# EAGLE design pcb_v3 (EAGLE 8.7.1)
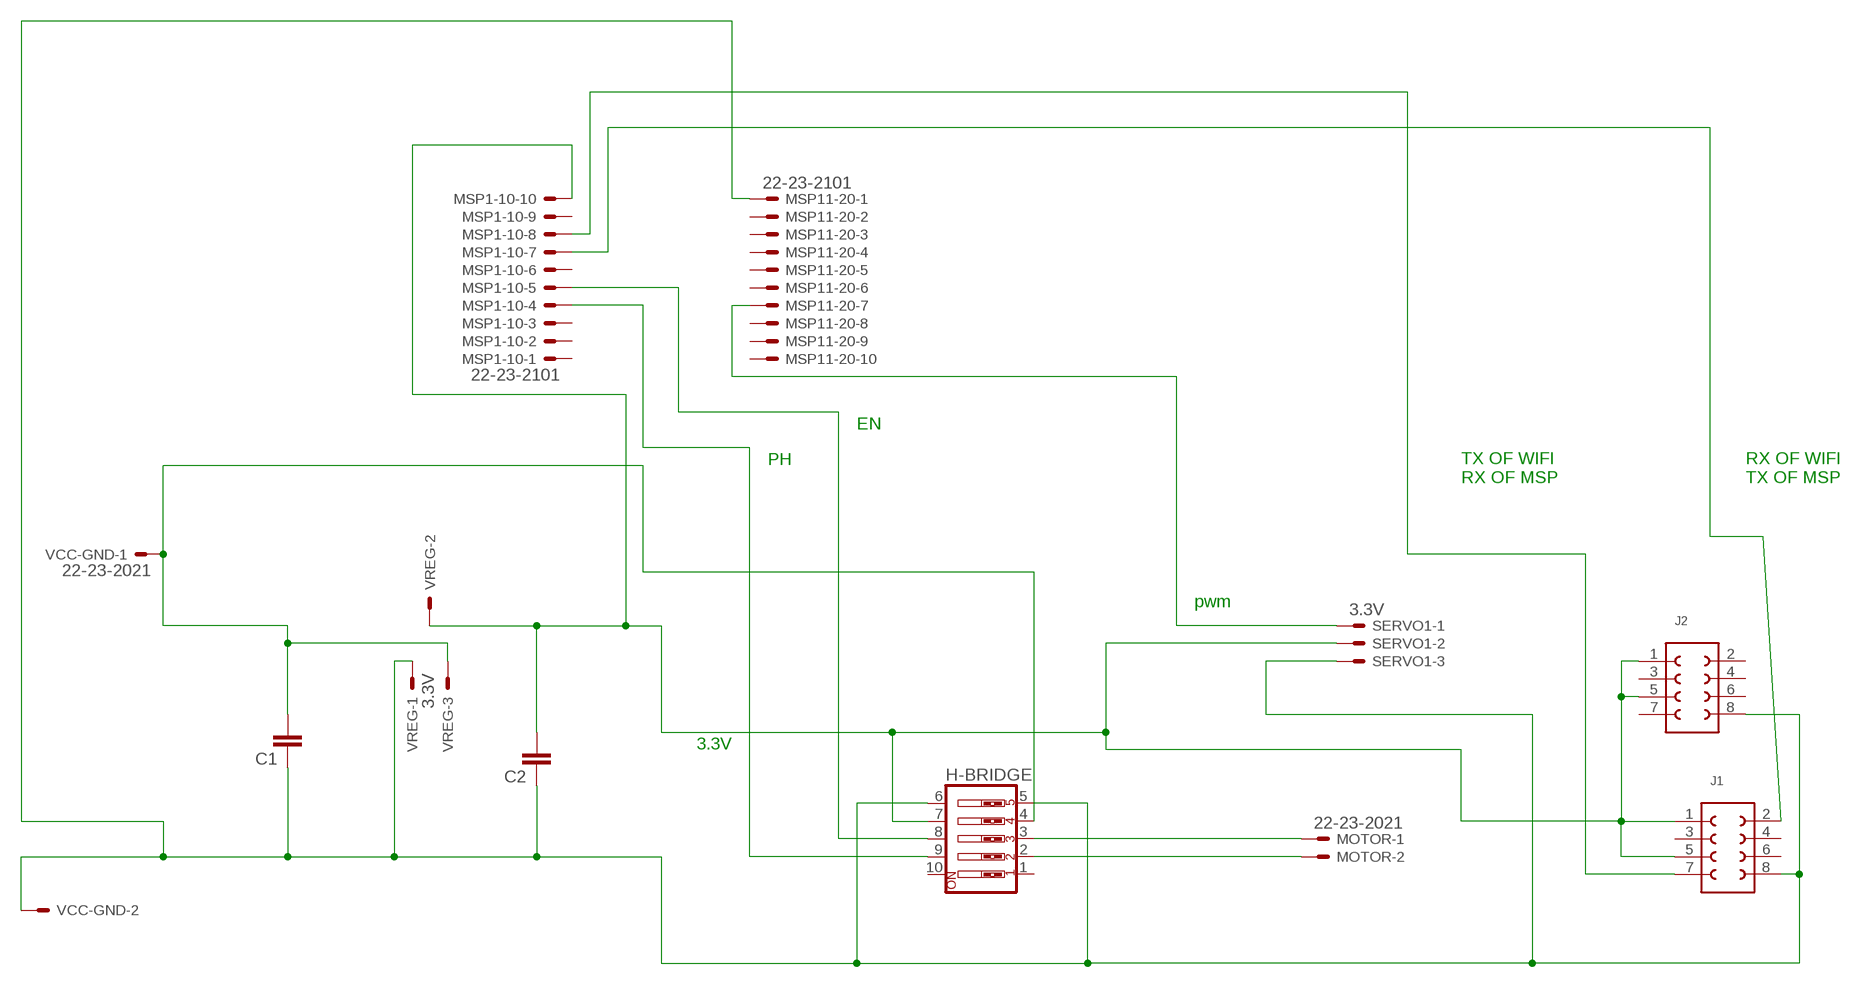
[diagram p0: schematic, sheet 1]

## Parts
C1  C2,5-3  [C2.5-3]
C2  C2,5-3  [C2.5-3]
H-BRIDGE  SW_DIP-5  [EDG-05]
J1  61300821121  [61300821121]
J2  61300821121  [61300821121]
MOTOR  22-23-2021  [22-23-2021]
MSP1-10  22-23-2101  [22-23-2101]
MSP11-20  22-23-2101  [22-23-2101]
SERVO1  3.3V  22-23-2031  [22-23-2031]
VCC-GND  22-23-2021  [22-23-2021]
VREG  3.3V  22-23-2031  [22-23-2031]

## Nets
N$1: J1.2 MSP1-10.7
N$3: J1.7 MSP1-10.8
N$4: C2.2 H-BRIDGE.7 J1.1 J1.5 J2.1 J2.5 MSP1-10.10 SERVO1.2 VREG.2
N$5: H-BRIDGE.3 MOTOR.1
N$6: H-BRIDGE.2 MOTOR.2
N$7: MSP11-20.7 SERVO1.1
N$11: H-BRIDGE.8 MSP1-10.5
N$12: C1.1 C2.1 H-BRIDGE.5 H-BRIDGE.6 J1.8 J2.8 MSP11-20.1 SERVO1.3 VCC-GND.2 VREG.1
N$13: H-BRIDGE.9 MSP1-10.4
N$14: C1.2 H-BRIDGE.4 VCC-GND.1 VREG.3
Unconnected: H-BRIDGE.1 H-BRIDGE.10 J1.3 J1.4 J1.6 J2.2 J2.3 J2.4 J2.6 J2.7 MSP1-10.1 MSP1-10.2 MSP1-10.3 MSP1-10.6 MSP1-10.9 MSP11-20.2 MSP11-20.3 MSP11-20.4 MSP11-20.5 MSP11-20.6 MSP11-20.8 MSP11-20.9 MSP11-20.10

## Notes on the sheet
- EN
- PH
- TX OF WIFI
  RX OF MSP
- RX OF WIFI
  TX OF MSP
- pwm
- 3.3V

## Library data of the parts
C1 C2 = capacitor-wima:C: CAPACITOR naming: grid - package width
H-BRIDGE = special:SW_DIP-5: DIP SWITCH
J1 J2 = Board-to-Board (rev17e):61300821121: Wr-PHD 2.54mm Dual Pin Header, 8 Pins =>Code : Con_BTB_PHD_2.54_2_61300821121 <http://katalog.we-online.de/media/images/eican/Con_BTB_PHD_2.54_2_6130xx21121_pf2.jpg> Details see: http://katalog.we-online.de/en/em/613_0xx_211_21 Created 2014-05-29, Karrer Zheng 2014 (C) Würth Elektronik
MOTOR VCC-GND = con-molex:22-23-2021: .100" (2.54mm) Center Header - 2 Pin; MF: MOLEX; MPN: 22-23-2021; OC_FARNELL: 1462926; OC_NEWARK: 25C3832
MSP1-10 MSP11-20 = con-molex:22-23-2101: .100" (2.54mm) Center Header - 10 Pin; MF: MOLEX; MPN: 22-23-2101; OC_FARNELL: 1756828; OC_NEWARK: 94C0765
SERVO1 VREG = con-molex:22-23-2031: .100" (2.54mm) Center Header - 3 Pin; MF: MOLEX; MPN: 22-23-2031; OC_FARNELL: 1462950; OC_NEWARK: 30C0862

## Board
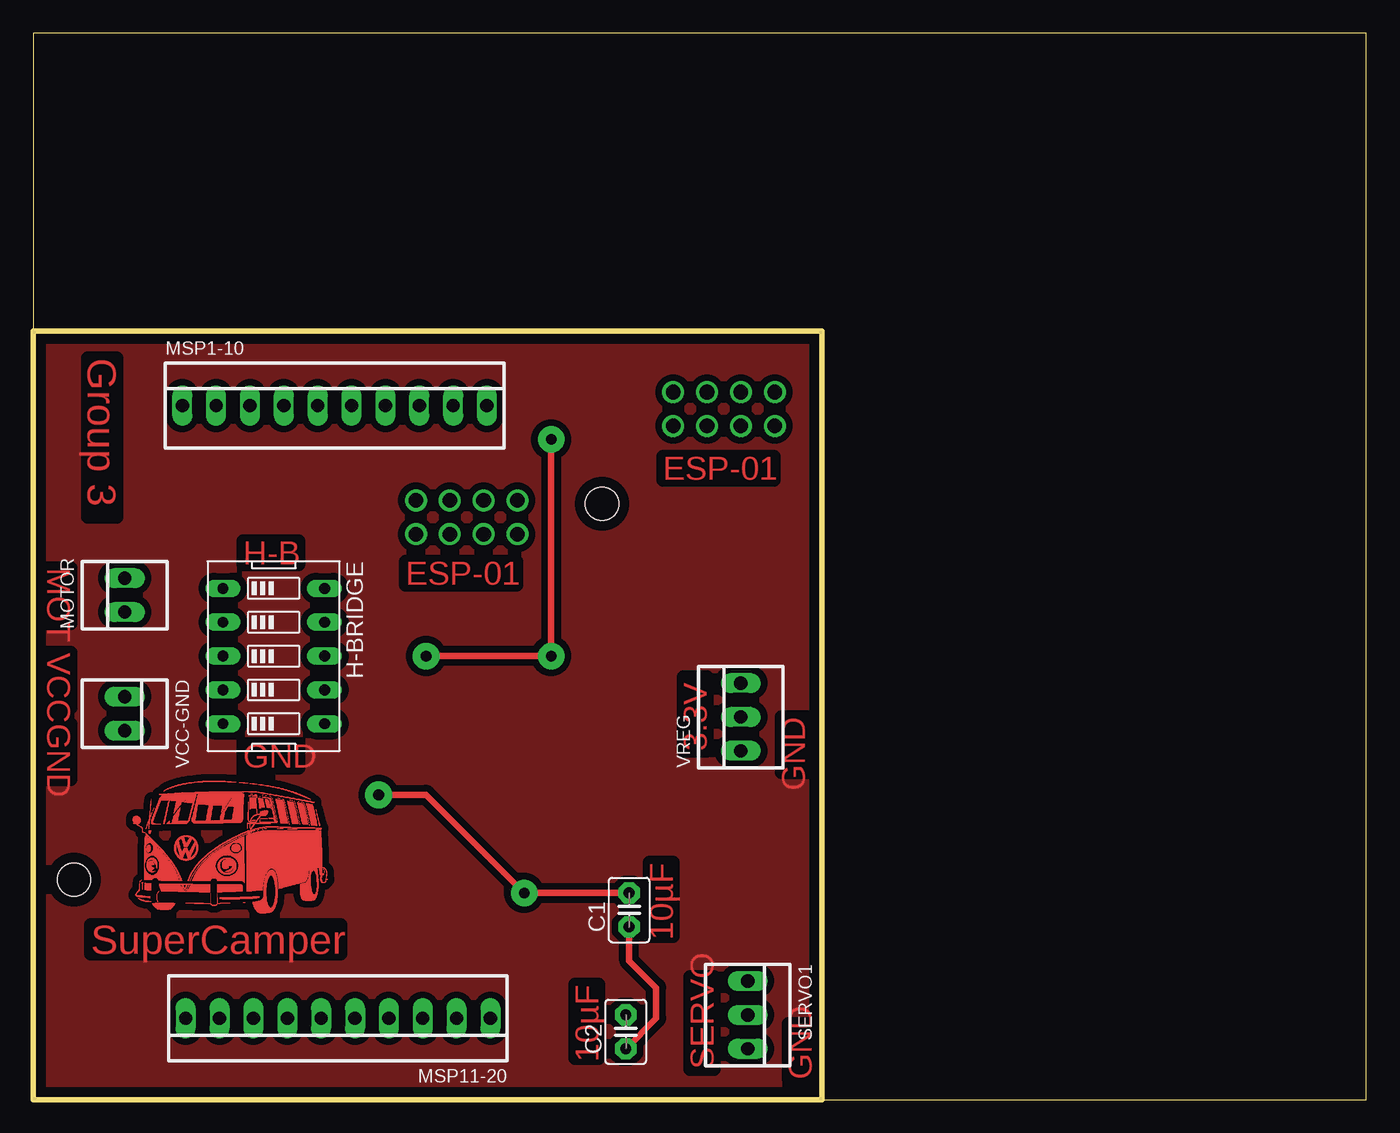
[diagram p1: board, top side]
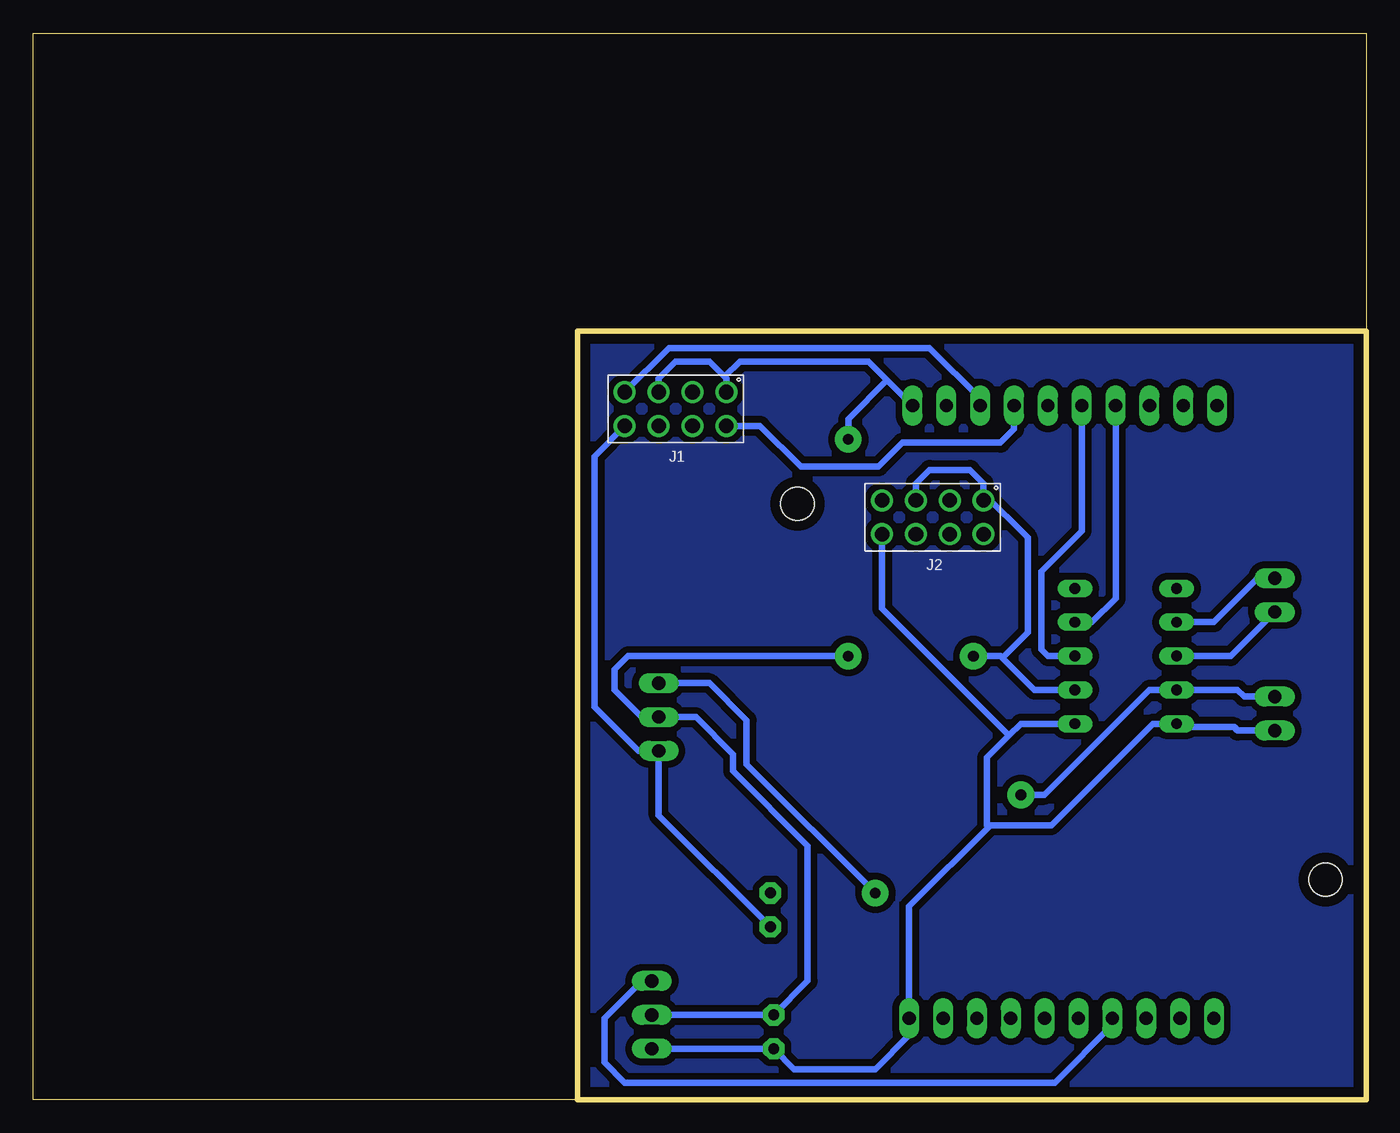
[diagram p2: board, bottom side, seen from below]

Size 100 x 80 mm. Coordinates in mm from the lower left corner, seen from the top.
Outline: 59.18,0 100,0 100,80 0,80 0,0
Outline: 0,0 59.18,0
Outline: 59.18,0 59.18,57.66 0,57.66 0,0
Copper layers (1*16): Top 0.035mm / dielectric 1.5mm / Bottom 0.035mm
Design rules "default *": minimum track width 0.5mm, minimum drill 0.8mm, track to track 0.5mm, track to pad 0.5mm, pad to pad 0.5mm, via to via 0.5mm, smd to smd 8mil, copper to edge 30mil, drill to drill 30mil, minimum pad ring 10mil, minimum via ring 8mil, stop-mask expansion 4mil, vias tented up to drill 0mil, thermal gap 10mil
Holes 2.5 mm at 3.05,16.51 42.67,44.7

### Footprints (pad centres in the part's own frame; a part is rotated, then mirrored left to right if it is on the bottom)
C2.5-3 = drill 0.813 pad 1.6 octagon: 1 -1.27,0; 2 1.27,0
EDG-05 = drill 0.813 long: 1 -5.08,-3.81; 2 -2.54,-3.81; 3 0,-3.81; 4 2.54,-3.81; 5 5.08,-3.81; 6 5.08,3.81; 7 2.54,3.81; 8 0,3.81; 9 -2.54,3.81; 10 -5.08,3.81
61300821121 = drill 1.1: 1 -3.81,-1.27; 2 -3.81,1.27; 3 -1.27,-1.27; 4 -1.27,1.27; 5 1.27,-1.27; 6 1.27,1.27; 7 3.81,-1.27; 8 3.81,1.27
22-23-2021 = drill 1 long: 1 -1.27,0; 2 1.27,0
22-23-2101 = drill 1 long: 1 -11.43,0; 2 -8.89,0; 3 -6.35,0; 4 -3.81,0; 5 -1.27,0; 6 1.27,0; 7 3.81,0; 8 6.35,0; 9 8.89,0; 10 11.43,0
22-23-2031 = drill 1 long: 1 -2.54,0; 2 0,0; 3 2.54,0

### Placement (x,y rotation side)
C1  44.7,14.22 90 top
C2  44.45,5.08 90 top
H-BRIDGE  18.03,33.27 270 top
J1  51.82,51.82 180 bottom
J2  32.51,43.69 180 bottom
MOTOR  6.86,37.85 90 top
MSP1-10  22.61,52.07 0 top
MSP11-20  22.86,6.1 180 top
SERVO1  53.59,6.35 270 top
VCC-GND  6.86,28.96 270 top
VREG  53.09,28.7 90 top

### Tracks (layer width: path | path; a pad name or v marks a point on that pad's centre or on a via)
N$1
  Bottom 0.5: J1.2 45.47,50.55 42.42,47.5 42.16,47.5 36.58,47.5 34.8,49.28 27.43,49.28 26.42,50.29 MSP1-10.7
N$3
  Bottom 0.5: J1.7 52.32,56.39 32.77,56.39 28.96,52.58 MSP1-10.8
N$4  (via drill 0.8 pad 2)
  Top 0.5: v38.86,49.53 v38.86,33.27 v29.46,33.27
  Bottom 0.5: J1.5 53.09,54.1 51.82,55.37 49.28,55.37 48.13,54.23 | 48.13,54.23 48.01,54.1 J1.1 | 48.13,54.23 46.99,55.37 37.34,55.37 35.94,53.98 | MSP1-10.10 35.94,53.98 | v38.86,49.53 38.86,51.05 35.94,53.98 | SERVO1.2 C2.2 41.91,8.89 41.91,19.05 47.5,24.64 47.5,25.91 50.29,28.7 VREG.2 54.36,28.7 56.39,30.73 56.39,32.26 55.37,33.27 v38.86,33.27 | 27.3,33.15 24.89,30.73 H-BRIDGE.7 | J2.5 33.78,46.23 32.77,47.24 29.72,47.24 28.7,46.23 28.7,45.47 | 28.7,45.47 25.4,42.16 25.4,35.05 27.3,33.15 | 28.7,45.47 J2.1 | 27.3,33.15 27.43,33.27 29.21,33.27 v29.46,33.27
N$5
  Bottom 0.5: H-BRIDGE.3 10.16,33.27 MOTOR.1
N$6
  Bottom 0.5: H-BRIDGE.2 11.43,35.81 8.13,39.12 MOTOR.2
N$7
  Bottom 0.5: SERVO1.1 54.1,9.14 57.15,6.1 57.15,2.79 55.63,1.27 23.37,1.27 19.05,5.59 MSP11-20.7
N$9
  pour Top: 0,57.66 59.18,57.66 59.18,0 0,0
N$11
  Bottom 0.5: H-BRIDGE.8 23.88,33.27 24.38,33.78 24.38,39.62 21.34,42.67 MSP1-10.5
N$12
  Top 0.5: C1.1 44.7,10.41 46.74,8.38 46.74,6.1 C2.1
  Bottom 0.5: H-BRIDGE.6 25.91,28.19 26.8,27.3 | 26.8,27.3 28.45,25.65 28.45,20.57 28.19,20.57 | 28.19,20.57 23.62,20.57 16,28.19 H-BRIDGE.5 14.22,27.94 9.91,27.94 9.65,27.69 VCC-GND.2 | 28.19,20.57 34.29,14.48 MSP11-20.1 34.29,4.83 36.83,2.29 42.93,2.29 C2.1 | C2.1 SERVO1.3 | 44.2,3.81 C2.1 | J1.8 57.91,48.26 57.91,29.46 54.61,26.16 VREG.1 53.09,21.34 C1.1 | J2.8 36.32,36.83 26.8,27.3
N$13
  Bottom 0.5: MSP1-10.4 18.8,37.59 20.57,35.81 H-BRIDGE.9
N$14  (via drill 0.8 pad 2)
  Top 0.5: v25.91,22.86 29.46,22.86 v36.83,15.49 C1.2
  Bottom 0.5: v25.91,22.86 24.13,22.86 16.26,30.73 H-BRIDGE.4 9.65,30.73 9.14,30.23 VCC-GND.1 | v36.83,15.49 46.48,25.15 46.48,28.45 49.28,31.24 VREG.3
N$15
  pour Bottom: 59.18,0 59.18,57.66 0,57.66 0,0
(copper drawn outside any net)
  shapes: Top area x4423

### Text on the board
Top: Group 3 | ESP-01 | MOT | H-B | ESP-01 | VCC | GND | GND | 3.3V | GND | 10µF | SuperCamper | 10µF | SERVO | GND
tPlace: C:/Users/mrdav/Desktop/EE579/SuperCamper/PCB/Logo2.bmp